# EAGLE design Isolated-ARD-Channel (EAGLE 6.3)
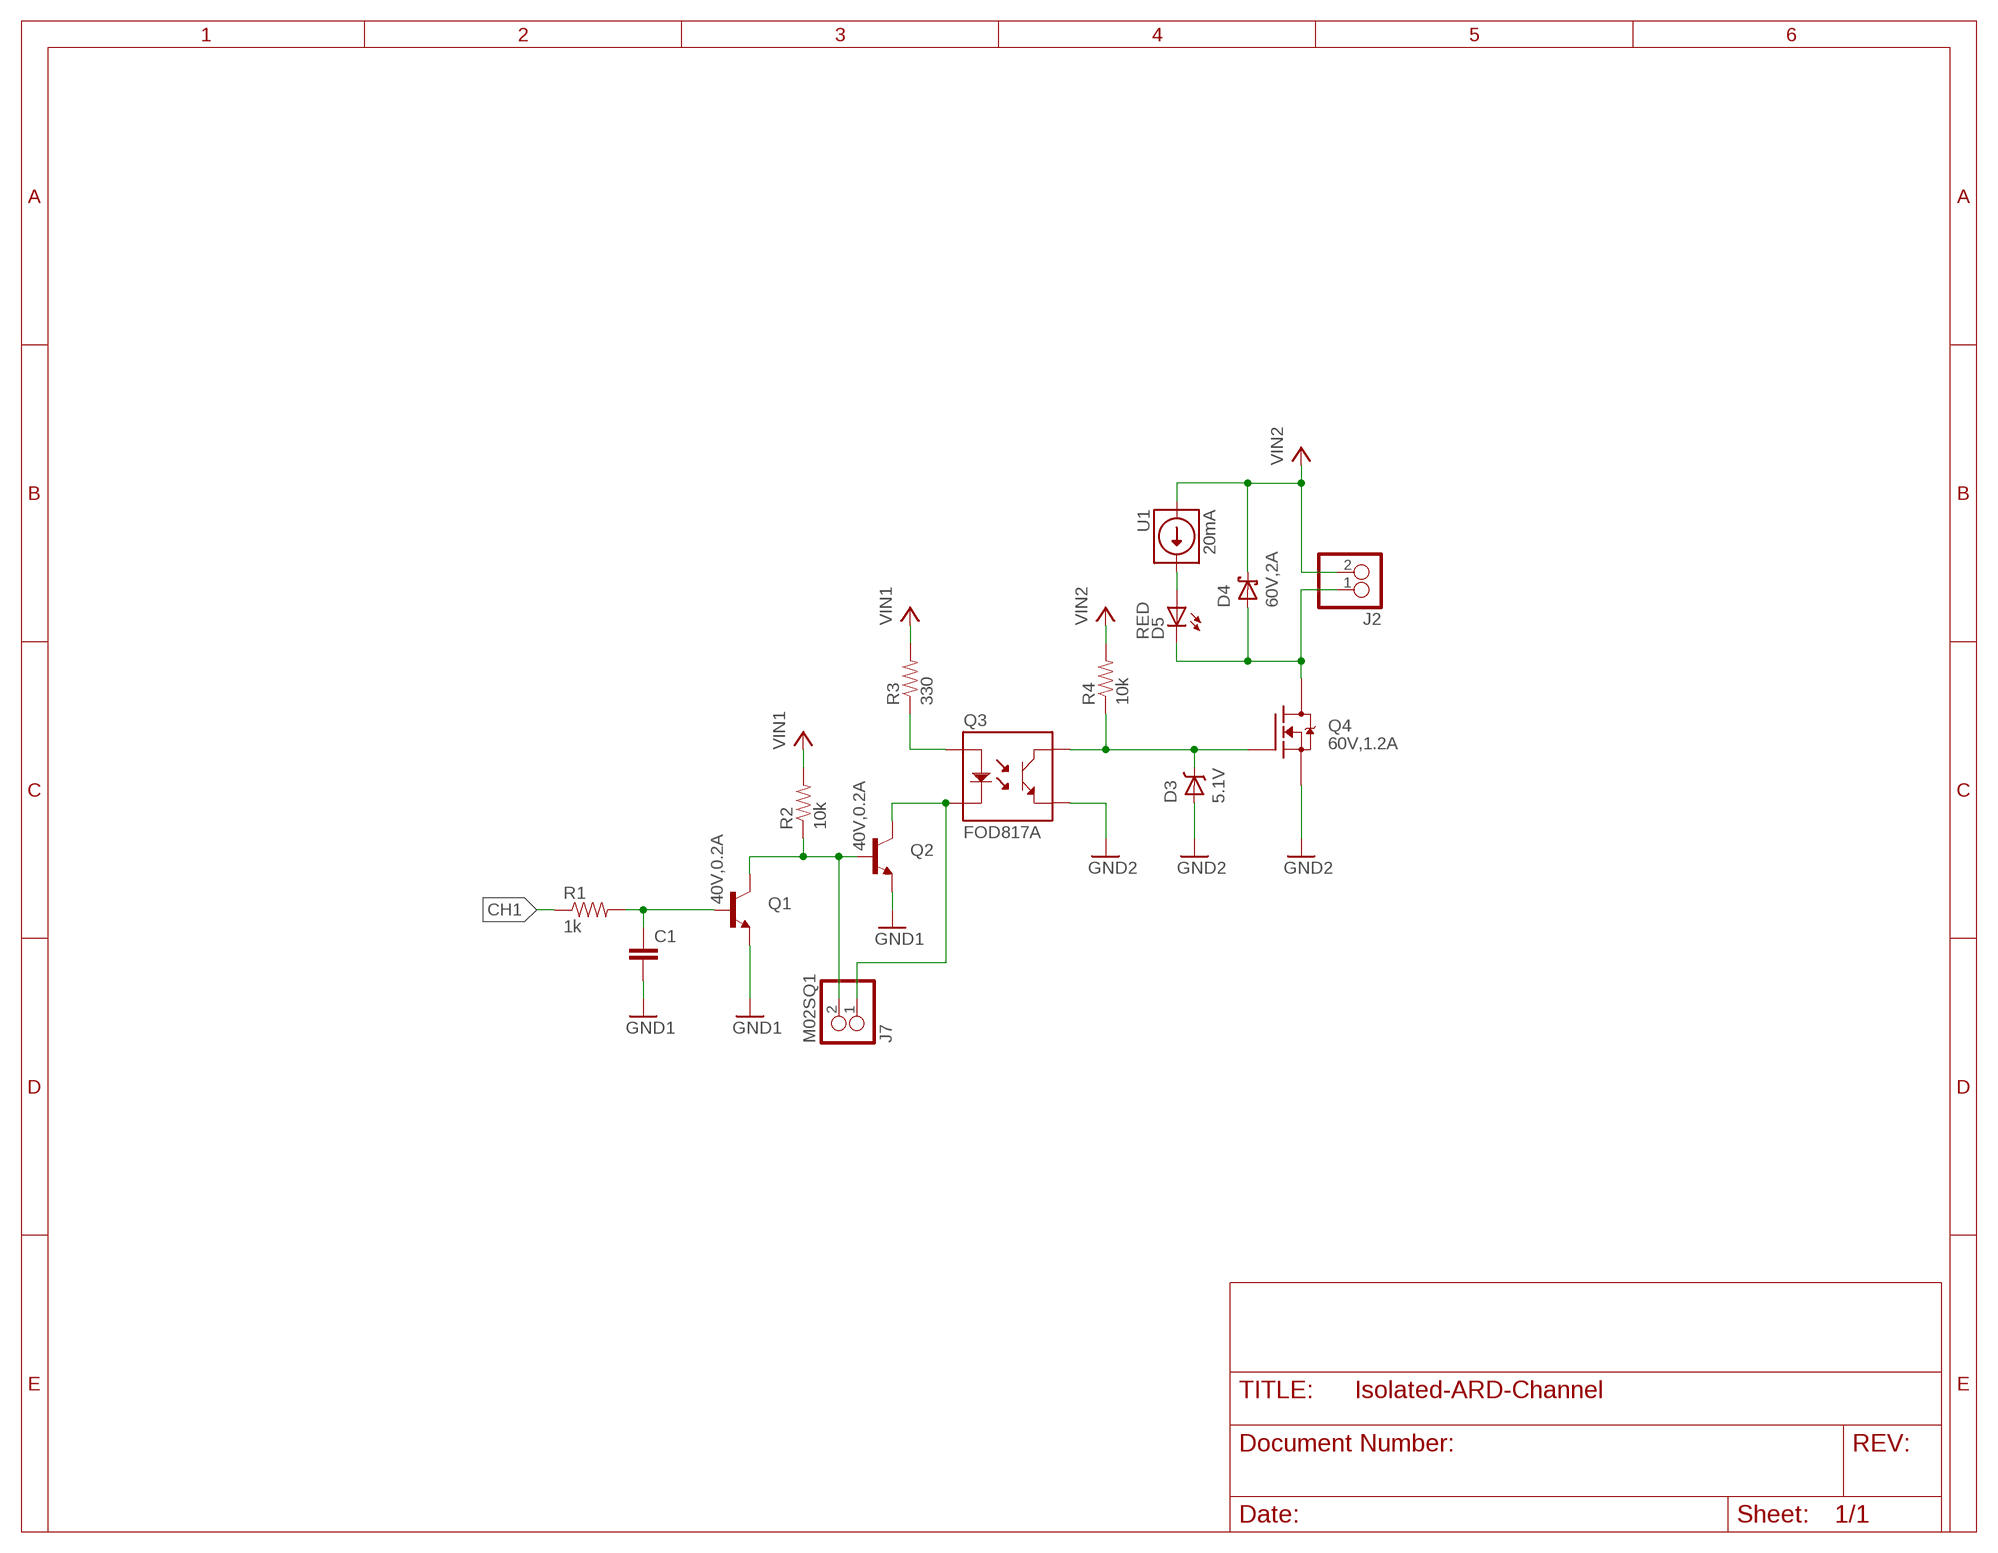
[diagram p0: schematic, sheet 1]

## Parts
C1  C-0805  [0805-CAP]
D3  5.1V  MMSZ5231B-7-F  [SOD-123]
D4  60V,2A  B260A-13-F  [SMA-DIODE]
D5  RED  LTST-C150KRKT  [1206-LED]
J2  M02SKT-3.5MM-R90  [SOCKET-3.5MM-2-R90]
J7  M02SQ1  [1X02_SQ1]
Q1  40V,0.2A  MMBT3904  [SOT23-3]
Q2  40V,0.2A  MMBT3904  [SOT23-3]
Q3  FOD817A  [4-SMD]
Q4  60V,1.2A  IRLML2060TRPBF  [SOT23-3]
R1  1k  1K-5%-0805  [0805-RES]
R2  10k  10K-5%-0805  [0805-RES]
R3  330  330-5%-0805  [0805-RES]
R4  10k  10K-5%-0805  [0805-RES]
U1  20mA  NSI45020T1G  [SOD-123]

## Nets
CH1: R1.P$1
GND1: C1.P$2 Q1.2(E) Q2.2(E)
GND2: D3.A Q3.3(T_E) Q4.2(S)
N$1: J7.2 Q1.3(C) Q2.1(B) R2.P$1
N$2: J7.1 Q2.3(C) Q3.2(LED_C)
N$3: Q3.1(LED_A) R3.P$1
N$4: C1.P$1 Q1.1(B) R1.P$2
N$5: D3.C Q3.4(T_C) Q4.1(G) R4.P$1
N$6: D4.A D5.C J2.1 Q4.3(D)
N$7: D5.A U1.C
VIN1: R2.P$2 R3.P$2
VIN2: D4.C J2.2 R4.P$2 U1.A

## Library data of the parts
C1 = LoganSmith-Capacitors:C-
D3 = LoganSmith-DiscreteSemi:MMSZ52*B?: Diodes Incorporated MMSZ52xxB series Zener MMSZ5221B-MMSZ5259B Datasheet <http://www.diodes.com/datasheets/ds18010.pdf>; DESC: Zener 5.1V 500mW SOD123, 900mV Vf; DIGIKEY_OC: MMSZ5231B-FDICT-ND; MFR: Diodes Incorporated; MPN: MMSZ5231B-7-F; TEMP: -65C to 150C
D4 = LoganSmith-DiscreteSemi:B2*: Diodes Incorporated B2xx* series Schottky diodes B220/A-B260/A Datasheet <http://www.diodes.com/datasheets/ds13004.pdf>; DESC: Schottky 60V 2A SMA, 700mV Vf; DIGIKEY_OC: B260A-FDICT-ND; MFR: Diodes Incorporated; MPN: B260A-13-F; TEMP: -65C to 150C
D5 = LoganSmith-LED:LTST-C?K*KT: LED from Lite-On Inc. Red: 0603 Datasheet <http://optoelectronics.liteon.com/upload/download/DS-22-99-0151/S_110_LTST-C190KRKT.pdf> 0805 Datasheet <http://optoelectronics.liteon.com/upload/download/DS-22-99-0150/S_110_LTST-C170KRKT.pdf> 1206 Datasheet <http://optoelectronics.liteon.com/upload/download/DS-22-99-0149/S_110_LTST-C150KRKT.pdf> Green: 0603 Datasheet <http://optoelectronics.liteon.com/upload/download/DS22-2000-074/S_110_LTST-C190KGKT.pdf> 0805 Datasheet <http://optoelectronics.liteon.com/upload/download/DS22-2000-073/S_110_LTST-C170KGKT.pdf> 1206 Datasheet <http://optoelectronics.liteon.com/upload/download/DS22-2000-072/S_110_LTST-C150KGKT.pdf>; DESC: Clear Red LED, 1206, 2V Vf, 20mA; DIGIKEY_OC: 160-1405-1-ND; HEIGHT: 1.1mm; MFR: Lite-On Inc.; MPN: LTST-C150KRKT; TEMP: -30C to 85C
J2 J7 = LoganSmith-Connectors:M02?: 1x2 Headers
Q1 Q2 = LoganSmith-DiscreteSemi:MMBT3904: 40V NPN Small Signal Transistor Datasheet <http://www.diodes.com/datasheets/ds30036.pdf>; DESC: NPN 40V 200mA SOT-23-3 350mW; DIGIKEY_OC: MMBT3904-FDICT-ND; MFR: Diodes Incorporated; MPN: MMBT3904-7-F; TEMP: -55C to 150C
Q3 = LoganSmith-DiscreteSemi:FOD817: 5kV Optoisolator, 1.2V Vf, 50mA, 70V output Datasheet <https://www.fairchildsemi.com/datasheets/FO/FOD817.pdf>; DESC: Optoisolator 5kV, Transistor Output, 1.2V Vf, 50mA If,; DIGIKEY_OC: FOD817DSDCT-ND; MFR: Fairchild Semiconductor; MPN: FOD817DSD; TEMP: -55C to 110C
Q4 = LoganSmith-DiscreteSemi:IRLML2060TRPBF: N-Channel MOSFET 60V 1.2A, HEXFET, Logic Level Gate, 1.25W Datasheet <http://www.irf.com/product-info/datasheets/data/irlml2060pbf.pdf>; DESC: MOSFET N-Channel 60V 1.2A SOT23-3 1.25W; DIGIKEY_OC: IRLML2060TRPBFCT-ND; MFR: International Rectifier; MPN: IRLML2060TRPBF; TEMP: -55C to 150C
R1 = LoganSmith-Resistors:1K-*-?: 1k Resistor, Panasonic; DIGIKEY_OC: P1.0KACT-ND; MFR: Panasonic Electronic Components; MPN: ERJ-6GEYJ102V; POWER: 0.125W
R2 R4 = LoganSmith-Resistors:10K-*-?: 10k Resistor, Panasonic; DESC: RES 10K OHM 1/8W 5% 0805 SMD; DIGIKEY_OC: P10KACT-ND; MFR: Panasonic Electronic Components; MPN: ERJ-6GEYJ103V; POWER: 0.125W
R3 = LoganSmith-Resistors:330-*-?: 330 Resistor, Panasonic; DIGIKEY_OC: P330ACT-ND; MFR: Panasonic Electronic Components; MPN: ERJ-6GEYJ331V; POWER: 0.125W
U1 = LoganSmith-DiscreteSemi:NSI45020T1G: 20mA Constant Current Driver for LED Datasheet <http://www.onsemi.com/pub_link/Collateral/NSI45020-D.PDF>; DESC: Constant Current Regulator, 45Vmax, 20mA +/-15%, SOD-123; DIGIKEY_OC: NSI45020T1GOSCT-ND; MFR: ON Semiconductor; MPN: NSI45020T1G; TEMP: -40C to 85C

## Board
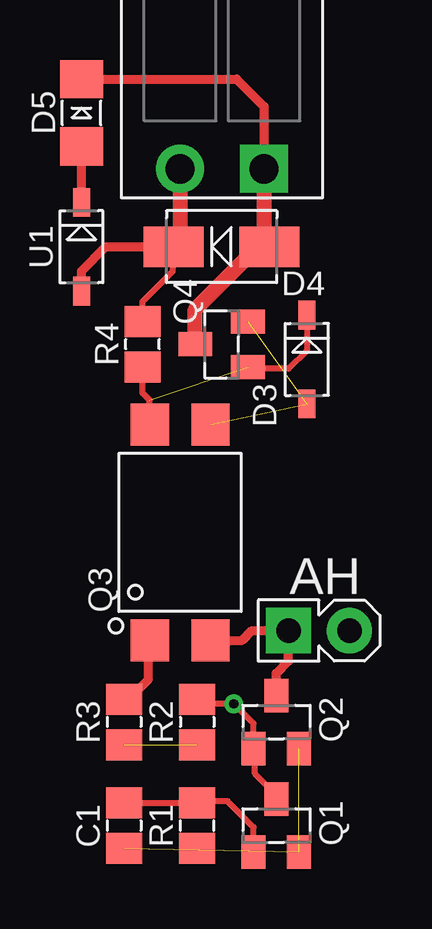
[diagram p1: board, top side]
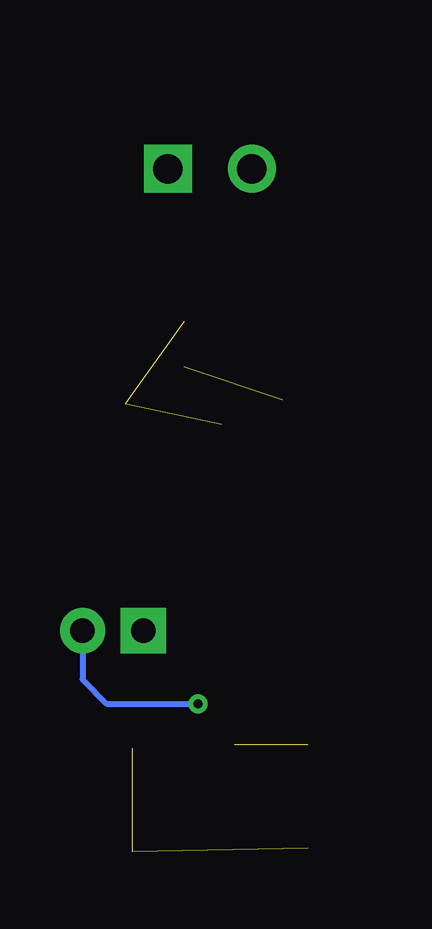
[diagram p2: board, bottom side, seen from below]

No outline drawn. Coordinates in mm, seen from the top.
Copper layers (1*16): Top 0.035mm / dielectric 1.5mm / Bottom 0.035mm
Design rules "default": minimum track width 10mil, minimum drill 24mil, track to track 8mil, track to pad 8mil, pad to pad 8mil, via to via 8mil, smd to smd 8mil, copper to edge 40mil, drill to drill 8mil, minimum pad ring 10mil, minimum via ring 8mil, stop-mask expansion 4mil, vias tented up to drill 0mil, thermal gap 10mil

### Footprints (pad centres in the part's own frame; a part is rotated, then mirrored left to right if it is on the bottom)
0805-CAP = smd 1.3 x 1.5: P$1 -0.95,0; P$2 0.95,0
SOD-123 = smd 1.2 x 0.7: A -1.85,0; C 1.85,0
SMA-DIODE = smd 2.5 x 1.7: A -2,0; C 2,0
1206-LED = smd 1.6 x 1.8: A -1.4,0; C 1.4,0
SOCKET-3.5MM-2-R90 = drill 1.22 pad 2 square: 1 3.5,0 | drill 1.22 pad 2: 2 0,0
1X02_SQ1 = drill 1.016 pad 1.88 square: 1 0,0 | drill 1.016 pad 1.88: 2 2.54,0
SOT23-3 = smd 1 x 1.4: 1 -0.95,-1.1; 2 0.95,-1.1; 3 0,1.1
4-SMD = smd 1.6 x 1.75: 1 0,0; 2 2.54,0; 3 2.54,9; 4 0,9
0805-RES = smd 1.3 x 1.5: P$1 -0.95,0; P$2 0.95,0

### Placement (x,y rotation side)
C1  12.45,10.92 270 top
D3  20.07,30.35 90 top
D4  16.51,35.05 180 top
D5  10.67,40.64 90 top
J2  14.78,38.3 0 top
J7  19.3,19.05 0 top
Q1  18.8,10.92 0 top
Q2  18.8,15.24 0 top
Q3  13.51,18.65 0 top
Q4  16.51,30.99 90 top
R1  15.49,10.92 90 top
R2  15.49,15.24 270 top
R3  12.45,15.24 270 top
R4  13.21,30.99 90 top
U1  10.67,35.05 90 top

### Tracks (layer width: path | path; a pad name or v marks a point on that pad's centre or on a via)
GND1  (2 unrouted)
GND2  (2 unrouted)
N$1  (via drill 0.38)
  Top 0.254: Q1.3 18.8,12.19 17.91,13.08 17.91,14.08 Q2.1 17.85,15.17 v17.02,16 15.68,16 R2.P$1
  Bottom 0.254: J7.2 21.84,17.02 20.83,16 v17.02,16
N$2
  Top 0.381: Q3.2 17.38,18.65 17.78,19.05 J7.1 19.3,17.78 18.8,17.27 Q2.3
N$3
  Top 0.381: R3.P$1 12.63,16.19 13.46,17.02 13.46,18.6 Q3.1
N$4
  Top 0.254: C1.P$1 R1.P$2 15.56,11.94 16.76,11.94 17.85,10.86 Q1.1
N$5  (1 unrouted)
  Top 0.254: Q3.4 13.51,28.65 13.21,28.96 R4.P$1 | D3.C 20.07,30.73 19.3,29.97 17.68,29.97 Q4.1
N$6
  Top 0.381: D5.C 17.14,42.04 18.29,40.89 J2.1
  Top 0.635: J2.1 18.28,35.28 D4.A 18.03,35.05 15.41,32.43 Q4.3
N$7
  Top 0.381: U1.C D5.A
VIN1  (1 unrouted)
VIN2
  Top 0.254: R4.P$2 13.21,32.77 14.48,34.04 14.48,35.02 D4.C
  Top 0.381: U1.A 10.67,34.04 11.68,35.05 D4.C
  Top 0.635: J2.2 14.78,35.32 D4.C

### Text on the board
tPlace: AH